# EAGLE design NEW MD 裏 - コピー (EAGLE 9.6.2)
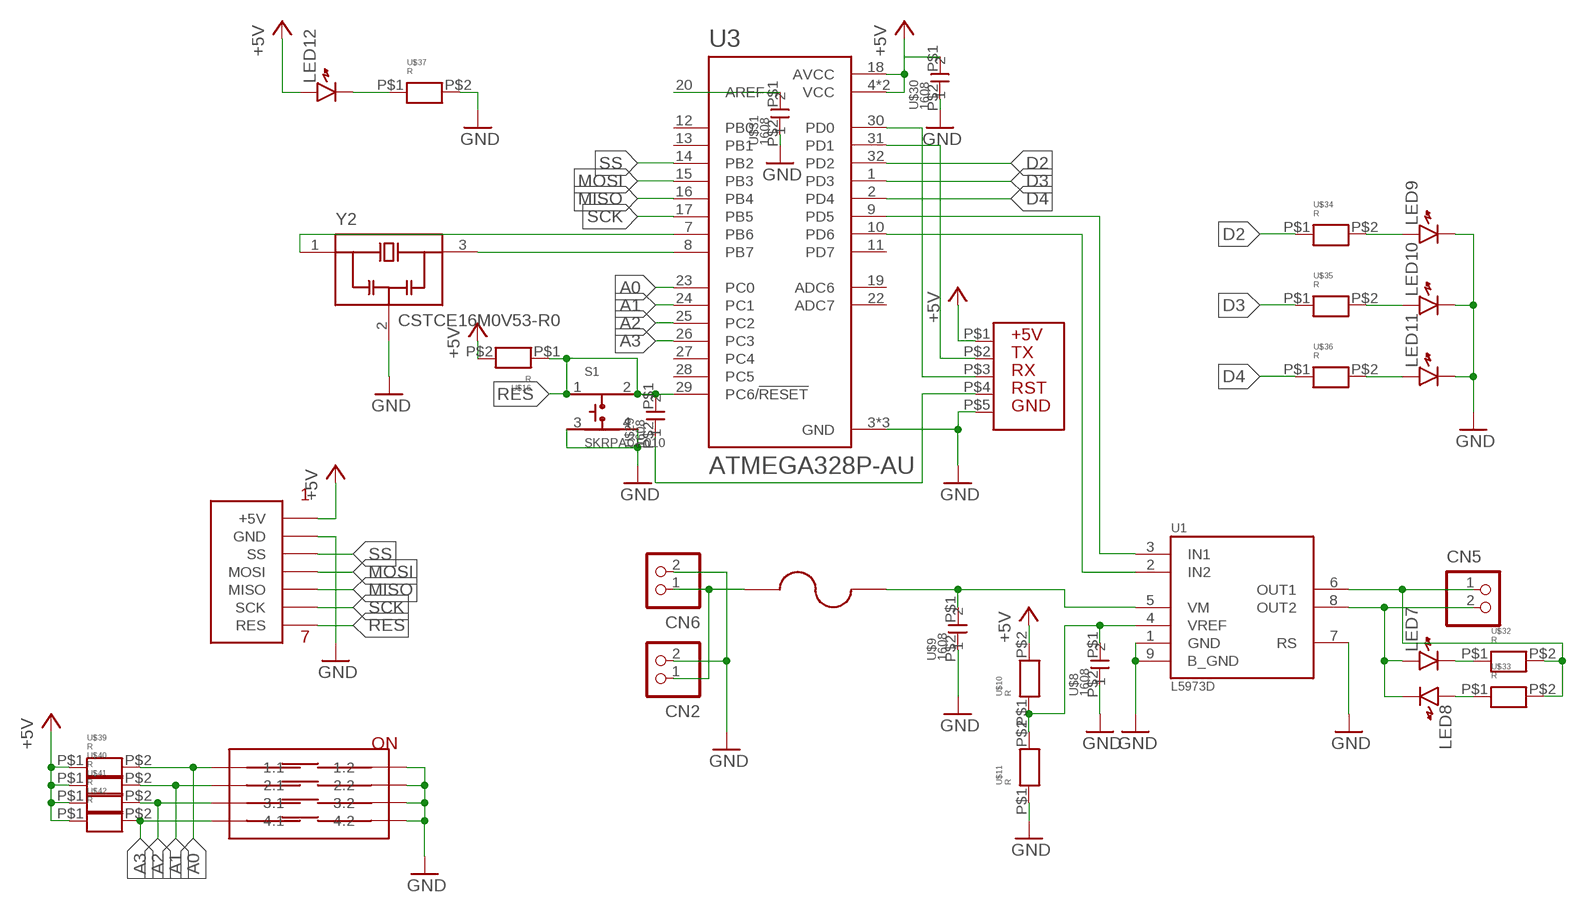
[diagram p0: schematic, sheet 1]

## Parts
CN2  B2B-XH-A  [B2B-XH-A]
CN5  S2B-XH-A  [S2B-XH-A]
CN6  B2B-XH-A  [B2B-XH-A]
LED7  LED1608  [LED1608]
LED8  LED1608  [LED1608]
LED9  LED1608  [LED1608]
LED10  LED1608  [LED1608]
LED11  LED1608  [LED1608]
LED12  LED1608  [LED1608]
S1  SKRPACE010  [SW_SKRPACE010]
U1  L5973D  [SOIC127P600X170-9N]
U3  ATMEGA328P-AU  [QFP80P900X900X120-32N]
U$1  FUSE3.7A  [FUSE3.7A]
U$8  1608  [CON]
U$9  1608  [CON]
U$10  R  [1608]
U$11  R  [1608]
U$16  R  [1608]
U$29  1608  [CON]
U$30  1608  [CON]
U$31  1608  [CON]
U$32  R  [1608]
U$33  R  [1608]
U$34  R  [1608]
U$35  R  [1608]
U$36  R  [1608]
U$37  R  [1608]
U$38  4P  [4P]
U$39  R  [1608]
U$40  R  [1608]
U$41  R  [1608]
U$42  R  [1608]
U$43  SPI  [SPI]
U$44  SI  [SI]
Y2  CSTCE16M0V53-R0  [OSC_CSTCE16M0V53-R0]

## Nets
+5V: LED12.A U3.4(VCC) U3.6(VCC) U3.18(AVCC) U$10.P$2 U$16.P$2 U$30.P$1 U$39.P$1 U$40.P$1 U$41.P$1 U$42.P$1 U$43.P$1(+5V) U$44.P$1
A0: U3.23(PC0) U$38.1.1 U$39.P$2
A1: U3.24(PC1) U$38.2.1 U$40.P$2
A2: U3.25(PC2) U$38.3.1 U$41.P$2
A3: U3.26(PC3) U$38.4.1 U$42.P$2
D2: U3.32(PD2) U$34.P$1
D3: U3.1(PD3) U$35.P$1
D4: U3.2(PD4) U$36.P$1
GND: CN2.2 CN6.2 LED9.K LED10.K LED11.K S1.3 S1.4 U1.1(GND) U1.7(RS) U1.9(B_GND) U3.3(GND) U3.5(GND) U3.21(GND) U$8.P$2 U$9.P$2 U$11.P$1 U$30.P$2 U$31.P$2 U$37.P$2 U$38.1.2 U$38.2.2 U$38.3.2 U$38.4.2 U$43.P$2(GND) U$44.P$5 Y2.2(GND)
MISO: U3.16(PB4) U$43.P$5(MISO)
MOSI: U3.15(PB3) U$43.P$4(MOSI)
N$8: U1.5(VM) U$1.P$2 U$9.P$1
N$9: U1.4(VREF) U$8.P$1 U$10.P$1 U$11.P$2
N$10: U3.20(AREF) U$31.P$1
N$11: U$29.P$2 U$44.P$4
N$12: U3.31(PD1) U$44.P$2
N$14: U3.30(PD0) U$44.P$3
N$20: CN2.1 CN6.1 U$1.P$1
N$21: CN5.2 LED7.A LED8.K U1.8(OUT2)
N$22: CN5.1 U1.6(OUT1) U$32.P$2 U$33.P$2
N$23: U1.2(IN2) U3.10(PD6)
N$26: U1.3(IN1) U3.9(PD5)
N$27: U3.7(PB6) Y2.1(IN)
N$28: U3.8(PB7) Y2.3(OUT)
N$29: LED8.A U$33.P$1
N$30: LED7.K U$32.P$1
N$34: LED10.A U$35.P$2
N$35: LED9.A U$34.P$2
N$36: LED11.A U$36.P$2
N$38: LED12.K U$37.P$1
RES: S1.1 S1.2 U3.29(PC6/!RESET) U$16.P$1 U$29.P$1 U$43.P$7(RES)
SCK: U3.17(PB5) U$43.P$6(SCK)
SS: U3.14(PB2) U$43.P$3(SS)
Unconnected: U3.11(PD7) U3.12(PB0) U3.13(PB1) U3.19(ADC6) U3.22(ADC7) U3.27(PC4) U3.28(PC5)

## Library data of the parts
CN2 CN6 = jst-xh:B2B-XH-A: Wire-to-Board 2.5mm pitch top mount connector Source: http://www.jst-mfg.com/product/pdf/jpn/XH.pdf http://www.jst-mfg.com/product/detail.php?series=277
CN5 = jst-xh:S2B-XH-A: Wire-to-Board 2.5mm pitch side mount connector Source: http://www.jst-mfg.com/product/pdf/jpn/XH.pdf http://www.jst-mfg.com/product/detail.php?series=277
LED7-LED12 = generic:LED: Generic LEDs
S1 = SKRPACE010:SKRPACE010: Switch Tactile N.O. SPST Button J-Bend 0.05A 16VDC 2.55N SMD Automotive T/R Check prices <https://pricing.snapeda.com/parts/SKRPACE010/ALPS/view-part?ref=eda>; AVAILABILITY: In Stock; DESCRIPTION: Switch Tactile N.O. SPST Button J-Bend 0.05A 16VDC 2.55N SMD Automotive T/R; MF: ALPS; MP: SKRPACE010; PACKAGE: None; PRICE: None
U1 = MD TOSHIBA:L5973D: L5973D Series 36 V 2.5 A Switch Step Down Switching Regulator SMT - HSOP-8 Check prices <https://pricing.snapeda.com/parts/L5973D/STMicroelectronics/view-part?ref=eda>; AVAILABILITY: In Stock; DESCRIPTION: Buck Switching Regulator IC Positive Adjustable 1.235V 1 Output 2.5A 8-SOIC (0.154, 3.90mm Width) Exposed Pad; MF: STMicroelectronics; MP: L5973D; PACKAGE: HSOP-8 STMicroelectronics; PRICE: None; PURCHASE-URL: https://pricing.snapeda.com/search/part/L5973D/?ref=eda
U3 = ATMEGA328P-AU:ATMEGA328P-AU: ATmega Series 20 MHz 32 KB Flash 2 KB SRAM 8-Bit Microcontroller - TQFP-32 Check prices <https://pricing.snapeda.com/parts/ATMEGA328P-AU/Microchip%20Technology/view-part?ref=eda>; AVAILABILITY: In Stock; DESCRIPTION: AVR AVR® ATmega Microcontroller IC 8-Bit 20MHz 32KB (16K x 16) FLASH 32-TQFP (7x7); MF: Microchip Technology; MP: ATMEGA328P-AU; PACKAGE: TQFP-32 Microchip; PRICE: None
U$1 = FUSE 3.7A:FUSE3.7A
U$8 U$9 U$29-U$31 = con1608:1608
U$10 U$11 U$16 U$32-U$37 U$39-U$42 = R 1608:R
U$38 = DIPスイッチ:4P
U$43 = SPI用PH7ピン:SPI
U$44 = プログラム入力:SI
Y2 = CSTCE16M0V53-R0:CSTCE16M0V53-R0: 20MHz Ceramic Resonator Built in Capacitor 15pF +/- 0.2% -40C - 125C Surface Mount; MANUFACTURER: Murata; MAXIMUM_PACKAGE_HEIGHT: 1.00mm; PARTREV: May 7, 2019; STANDARD: Manufacturer Recommendations

## Board
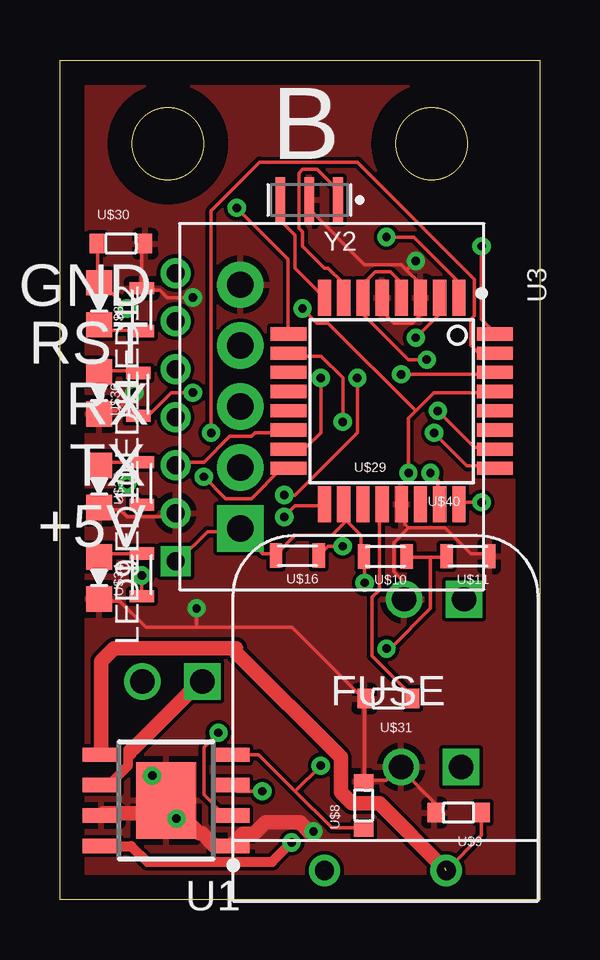
[diagram p1: board, top side]
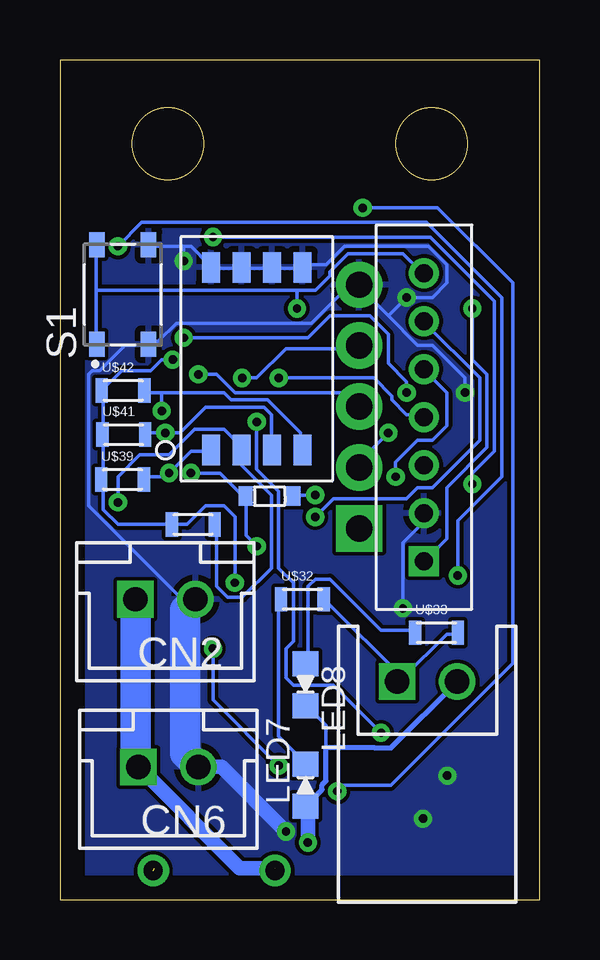
[diagram p2: board, bottom side, seen from below]

Size 20 x 34.99 mm. Coordinates in mm from the lower left corner, seen from the top.
Outline: 0,34.99 20,34.98 20,0.01 0,0 0,34.99
Outline: circle at 4.5,31.5 radius 1.5
Outline: circle at 15.5,31.5 radius 1.5
Outline: circle at 4.5,31.5 radius 1.5
Outline: circle at 15.5,31.5 radius 1.5
Copper layers (1*16): Top 0.035mm / dielectric 1.5mm / Bottom 0.035mm
Design rules "default": minimum track width 6mil, minimum drill 0.35mm, track to track 6mil, track to pad 6mil, pad to pad 6mil, via to via 6mil, smd to smd 6mil, copper to edge 40mil, drill to drill 6mil, minimum pad ring 10mil, minimum via ring 8mil, stop-mask expansion 4mil, vias tented up to drill 0mil, thermal gap 10mil

### Footprints (pad centres in the part's own frame; a part is rotated, then mirrored left to right if it is on the bottom)
B2B-XH-A = drill 1.016 square: 1 -1.25,0 | drill 1.016: 2 1.25,0
S2B-XH-A = drill 1.016 square: 1 1.25,0 | drill 1.016: 2 -1.25,0
LED1608 = smd 1.05 x 1.08: A -0.875,0; K 0.875,0
SW_SKRPACE010 = smd 1.05 x 0.65: 1 -2.075,1.075; 2 2.075,1.075; 3 -2.075,-1.075; 4 2.075,-1.075
SOIC127P600X170-9N = smd 1.55 x 0.6: 1 -2.7,1.905; 2 -2.7,0.635; 3 -2.7,-0.635; 4 -2.7,-1.905; 5 2.7,-1.905; 6 2.7,-0.635; 7 2.7,0.635; 8 2.7,1.905 | smd 2.5 x 3.2: 9 0,0
QFP80P900X900X120-32N = smd 1.5 x 0.55: 1 -4.3,2.8; 2 -4.3,2; 3 -4.3,1.2; 4 -4.3,0.4; 5 -4.3,-0.4; 6 -4.3,-1.2; 7 -4.3,-2; 8 -4.3,-2.8; 17 4.3,-2.8; 18 4.3,-2; 19 4.3,-1.2; 20 4.3,-0.4; 21 4.3,0.4; 22 4.3,1.2; 23 4.3,2; 24 4.3,2.8 | smd 0.55 x 1.5: 9 -2.8,-4.3; 10 -2,-4.3; 11 -1.2,-4.3; 12 -0.4,-4.3; 13 0.4,-4.3; 14 1.2,-4.3; 15 2,-4.3; 16 2.8,-4.3; 25 2.8,4.3; 26 2,4.3; 27 1.2,4.3; 28 0.4,4.3; 29 -0.4,4.3; 30 -1.2,4.3; 31 -2,4.3; 32 -2.8,4.3
FUSE3.7A = drill 0.8: P$1 0,0; P$2 5.08,0
CON = smd 0.6 x 0.813: P$1 -1,0; P$2 1,0
1608 = smd 0.508 x 1.016: P$1 -0.889,0; P$2 0.889,0
4P = smd 0.76 x 1.27: 1.1 0,0; 1.2 0,7.62; 2.1 1.27,0; 2.2 1.27,7.62; 3.1 2.54,0; 3.2 2.54,7.62; 4.1 3.81,0; 4.2 3.81,7.62
SPI = drill 0.75 square: P$1 0,0 | drill 0.75: P$2 2,0; P$3 4,0; P$4 6,0; P$5 8,0; P$6 10,0; P$7 12,0
SI = drill 1.1 pad 1.93 square: P$1 -7.62,0 | drill 1.1 pad 1.93: P$2 -5.08,0; P$3 -2.54,0; P$4 0,0; P$5 2.54,0
OSC_CSTCE16M0V53-R0 = smd 0.4 x 1.9: 1 -1.2,0; 2 0,0; 3 1.2,0

### Placement (x,y rotation side)
CN2  15.6,12.52 0 bottom
CN5  4.68,9.09 180 bottom
CN6  15.48,5.54 0 bottom
LED7  9.76,4.77 90 bottom
LED8  9.76,8.96 270 bottom
LED9  1.63,13.41 270 top
LED10  1.63,17.22 270 top
LED11  1.63,21.12 270 top
LED12  1.63,24.84 270 top
S1  17.38,25.22 90 bottom
U1  4.43,4.14 180 top
U3  13.84,20.78 270 top
U$1  11.03,1.22 0 top
U$8  12.67,3.94 90 top
U$9  16.62,3.63 180 top
U$10  13.57,14.3 180 top
U$11  17.01,14.31 180 top
U$16  9.9,14.34 180 top
U$29  11.26,16.81 0 bottom
U$30  2.55,27.34 0 top
U$31  13.7,8.38 180 top
U$32  9.89,12.52 0 bottom
U$33  4.3,11.12 0 bottom
U$34  3.41,13.54 90 top
U$35  3.41,17.35 90 top
U$36  3.27,21.06 90 top
U$37  3.41,24.59 90 top
U$38  13.7,18.73 0 bottom
U$39  17.39,17.51 0 bottom
U$40  14.45,15.63 0 bottom
U$41  17.34,19.38 0 bottom
U$42  17.37,21.22 0 bottom
U$43  4.82,14.11 90 bottom
U$44  7.52,23.09 90 top
Y2  10.4,29.16 180 top

### Tracks (layer width: path | path; a pad name or v marks a point on that pad's centre or on a via)
+5V  (via drill 0.35)
  Top 0.152: U3.4 14.23,25.09 14.23,25.7 13.77,26.16 13.16,26.16 12.71,25.7 12.71,25.09 U3.6 12.71,24.94 12.71,24.33 14.54,22.5 v15.3,22.5 | 11.94,15.8 12.55,15.19 12.55,14.43 U$10.P$2 12.71,14.27 v12.71,13.21 | 11.94,15.8 11.94,16.41 U3.18 11.94,15.8 | 7.53,15.34 8.44,14.43 8.9,14.43 U$16.P$2 9.05,14.43 9.81,15.19 11.34,15.19 11.94,15.8 | U$30.P$1 1.58,27.23 1.58,25.86 LED12.A 1.73,25.7 v2.8,24.64 | 7.53,15.34 6.15,15.34 4.93,14.12 U$43.P$1 | 7.53,15.34 U$44.P$1
  Bottom 0.152: v15.3,22.5 15.75,22.5 16.21,22.05 17.43,22.05 U$42.P$1 18.19,21.13 18.19,19.46 U$41.P$1 18.19,19.3 18.19,17.63 U$39.P$1 18.19,17.47 18.19,16.25 17.58,15.64 15.45,15.64 U$40.P$1 15.3,15.64 14.69,15.64 13.93,16.41 13.16,16.41 12.71,15.95 v12.71,13.21 | v2.8,24.64 2.8,22.5 2.19,21.89 2.19,18.85 3.87,17.17 3.87,15.04 4.78,14.12 U$43.P$1
A0  (via drill 0.35)
  Top 0.152: v15.45,17.78 15.75,17.47 15.75,16.56 U3.23
  Bottom 0.152: U$39.P$2 16.36,17.63 15.6,17.63 v15.45,17.78 14.54,18.69 13.77,18.69 U$38.1.1
A1  (via drill 0.35)
  Top 0.152: v17.58,16.56 16.67,16.56 U3.24
  Bottom 0.152: U$40.P$2 13.47,15.49 13.47,13.05 13.01,12.6 12.4,12.6 11.18,13.82 11.18,16.86 12.4,18.08 12.4,18.69 U$38.2.1 12.4,18.85 13.16,19.61 14.38,19.61 15.45,18.54 16.67,18.54 17.58,17.63 v17.58,16.56
A2  (via drill 0.35)
  Top 0.152: v15.6,19.46 16.97,18.08 18.04,18.08 U3.25
  Bottom 0.152: U$41.P$2 16.36,19.46 v15.6,19.46 14.99,19.46 13.93,20.52 11.49,20.52 11.18,20.22 11.18,18.85 U$38.3.1
A3  (via drill 0.35)
  Top 0.152: v15.75,20.37 17.28,18.85 18.04,18.85 U3.26
  Bottom 0.152: 15.75,21.13 13.16,21.13 12.86,20.83 11.34,20.83 9.96,19.46 9.96,18.85 U$38.4.1 | 15.75,21.13 16.36,21.13 U$42.P$2 | 15.75,21.13 v15.75,20.37
D2  (via drill 0.35)
  Top 0.152: v3.41,13.51 U$34.P$1 | v17.58,27.23 17.58,24.18 18.04,23.72 U3.32
  Bottom 0.152: v3.41,13.51 3.41,15.8 1.58,17.63 1.58,25.09 4.71,28.22 16.59,28.22 v17.58,27.23
D3  (via drill 0.35)
  Top 0.152: v2.8,17.32 2.8,17.17 3.41,16.56 U$35.P$1 | v13.62,27.61 14.76,27.61 16.52,25.86 16.52,25.09 U3.1
  Bottom 0.152: v2.8,17.32 2.8,17.78 1.89,18.69 1.89,24.94 4.56,27.61 v13.62,27.61
D4  (via drill 0.35)
  Top 0.152: v5.54,21.13 4.63,21.13 3.72,20.22 3.41,20.22 U$36.P$1 | v14.84,23.42 15.75,24.33 15.75,24.94 U3.2
  Bottom 0.152: v5.54,21.13 5.54,21.59 6.31,22.35 6.31,23.57 7.07,24.33 8.74,24.33 9.66,23.42 v14.84,23.42
GND  (via drill 0.35)
  Top 0.152: U3.5 13.47,24.94 13.47,24.48 13.93,24.03 14.69,24.03 14.99,24.33 14.99,24.94 U3.3 14.99,25.09 14.99,25.7 14.46,26.24 | 14.46,26.24 14.23,26.47 12.71,26.47 10.42,28.75 10.42,29.06 Y2.2 | U$30.P$2 3.41,27.23 U$37.P$2 3.41,25.4 4.17,25.4 4.48,25.09 v5.54,25.09 | v3.11,21.13 2.34,20.37 1.73,20.37 LED11.K | v14.84,26.62 14.46,26.24 | 14.54,15.49 16.06,15.49 17.13,14.43 17.89,14.43 U$11.P$1 | 14.54,15.49 14.38,15.64 14.38,16.41 U3.21 | 14.54,15.49 13.93,14.88 13.93,13.66 14.23,13.36 14.23,12.6 CN2.2 | 3.87,3.61 4.32,4.06 U1.9 | LED10.K 1.73,16.25 2.5,16.25 2.8,15.95 4.63,15.95 4.78,16.1 U$43.P$2 | 12.71,4.98 13.62,4.98 14.08,5.43 CN6.2 14.23,5.43 15.6,4.06 15.6,3.76 U$9.P$2 | 12.71,4.98 12.71,8.33 U$31.P$2 12.55,8.48 9.68,11.35 5.7,11.35 | 12.71,4.98 U$8.P$2 | 5.7,11.35 3.59,11.35 2.5,12.45 1.73,12.45 LED9.K | 5.7,11.35 v5.7,12.14
  Top 0.61: U1.7 1.83,3.61 3.87,3.61 | U1.9 5.8,2.77 5.92,2.77 6.45,2.23 U1.1 7.64,2.75 8.09,2.75 8.56,3.22 10,3.22 10.38,2.84 v10.57,2.84
  Bottom 0.152: 14.84,27.23 14.54,27.23 13.77,26.47 U$38.1.2 13.62,26.31 12.55,26.31 U$38.2.2 12.4,26.31 11.18,26.31 U$38.3.2 11.03,26.31 9.96,26.31 U$38.4.2 9.81,26.47 8.9,26.47 8.13,27.23 4.63,27.23 3.87,26.47 3.87,25.7 4.48,25.09 v5.54,25.09 6.31,24.33 | 14.84,27.23 16.21,27.23 S1.4 | 7.53,25.55 7.98,25.55 9.51,24.03 15.15,24.03 15.91,23.27 16.21,23.27 S1.3 16.36,23.11 17.28,23.11 18.34,22.05 18.65,22.05 18.8,21.89 18.8,16.41 14.99,12.6 14.38,12.6 CN2.2 | v3.11,21.13 3.11,21.74 4.48,23.11 5.09,23.11 6.31,24.33 | 7.53,25.55 6.31,24.33 | 7.53,25.55 U$44.P$5 | 14.84,27.23 v14.84,26.62 | v5.7,12.14 5.7,14.88 4.93,15.64 4.93,16.1 U$43.P$2
  Bottom 0.61: v10.57,2.84 13.27,5.54 CN6.2 14.46,5.77
  Bottom 1.27: CN2.2 14.79,12.09 14.79,6.1 14.46,5.77
  other vias: 3.85,5.17 4.86,3.38
  pour Top: -6.75,40.08 -6.75,-3.1 22.46,-3.1 22.46,40.08
  pour Bottom: -8.02,40.08 -8.02,-4.37 23.73,-4.37 23.73,41.35 -8.02,41.35
MISO  (via drill 0.35)
  Top 0.152: v6,17.63 6.92,16.71 7.98,16.71 9.2,17.93 9.51,17.93 U3.16
  Bottom 0.152: v6,17.63 6,18.24 5.09,19.15 4.48,19.15 3.87,19.76 3.87,21.13 4.78,22.05 U$43.P$5
MOSI  (via drill 0.35)
  Top 0.152: v10.88,21.74 10.88,19.46 10.27,18.85 9.66,18.85 U3.15
  Bottom 0.152: v10.88,21.74 6.92,21.74 6.15,20.98 6.15,20.83 5.54,20.22 4.93,20.22 U$43.P$4
N$8  (1 unrouted)
  Top 0.152: U$1.P$2 17.58,2.69 17.58,3.61 U$9.P$1
  Top 0.61: 16.06,1.32 16.11,1.32 | U$1.P$2 13.32,4.01 12.17,4.01 11.71,4.47 11.71,5.93 7.35,10.3 7.35,10.49 2.27,10.49 1.73,9.95 U1.5
N$9  (via drill 0.35)
  Top 0.152: 15.45,14.27 16.06,14.27 U$11.P$2 | 15.45,14.27 14.54,14.27 U$10.P$1 | 9.81,4.52 8.29,6.04 U1.4 | 9.81,4.52 11.34,3 12.55,3 U$8.P$1 | 15.45,14.27 15.45,12.14 13.77,10.46 v13.62,10.46 | 9.81,4.52 v10.88,5.59
  Bottom 0.152: v13.62,10.46 13.62,8.33 v10.88,5.59
N$10
  Top 0.152: U$31.P$1 14.69,8.48 13.01,10.16 13.01,12.6 13.32,12.9 13.32,16.41 U3.20
N$11  (via drill 0.35)
  Top 0.152: v9.35,16.86 9.81,16.86 12.4,19.46 v12.4,21.74
  Bottom 0.152: v9.35,16.86 10.12,16.86 U$29.P$2 | v12.4,21.74 11.79,21.74 10.57,22.96 7.53,22.96 U$44.P$4
N$12  (via drill 0.35)
  Top 0.152: v6.31,19.46 6.31,28.71 8.33,30.73 12.4,30.73 17.28,25.86 17.28,24.33 17.13,24.18 17.13,23.11 17.43,22.81 18.04,22.81 U3.31
  Bottom 0.152: v6.31,19.46 7.53,18.24 U$44.P$2
N$14  (via drill 0.35)
  Top 0.152: v14.23,21.89 18.04,21.89 U3.30
  Bottom 0.152: v14.23,21.89 13.47,21.89 12.71,21.13 7.98,21.13 7.53,20.67 U$44.P$3
N$20  (1 unrouted)
  Bottom 0.152: 11.03,1.32 U$1.P$1
  Bottom 0.61: CN6.1 12.51,1.32 11.03,1.32
  Bottom 1.27: CN2.1 16.85,9.6 16.85,5.66 CN6.1
N$21  (via drill 0.35)
  Top 0.406: U1.8 2.98,2.23 3.64,1.57 8.85,1.57 v9.66,2.39
  Bottom 0.152: 8.9,6.35 8.9,7.26 9.66,8.03 LED8.K | 9.66,3.76 LED7.A
  Bottom 0.203: LED7.A 9.07,4.59 9.07,4.78 8.9,4.96 8.9,6.35 6.9,6.35 6.87,6.33 6.2,6.33 CN5.2
  Bottom 0.61: v9.66,2.39 9.66,3.76
N$22
  Top 0.152: 2.8,5.59 2.8,6.04 2.8,6.34
  Top 0.203: 3.09,6.33 3.09,6.04 2.92,5.87 2.92,5.56 2.82,5.56 | 2.59,5.33 2.76,5.5 2.76,6.3 2.8,6.34 | 2.8,6.04 2.98,6.22
  Top 0.406: U1.6 2.03,4.77 2.59,5.33 2.82,5.56
  Top 0.61: CN5.1 5.85,9.09 3.09,6.33 2.98,6.22
  Bottom 0.152: 5.7,9.24 5.85,9.09 CN5.1 5.7,9.24 | 5.7,9.24 3.87,11.07 3.41,11.07 U$33.P$2 | 5.7,9.24 8.9,12.45 U$32.P$2
N$23  (via drill 0.35)
  Top 0.152: v11.79,19.91 11.79,21.74 10.88,22.66 9.66,22.66 U3.10 | v6.61,6.96 6,6.35 6,4.37 6.76,3.61 7.07,3.61 U1.2
  Bottom 0.152: v11.79,19.91 11.79,17.93 10.88,17.02 10.88,13.82 10.27,13.21 10.27,10.77 10.57,10.46 10.57,9.24 10.27,8.94 8.59,8.94 v6.61,6.96
N$26  (via drill 0.35)
  Top 0.152: v7.37,28.83 9.51,26.7 9.51,23.72 U3.9 | v8.44,4.52 7.37,4.52 7.22,4.67 U1.3
  Bottom 0.152: v7.37,28.83 4.25,28.83 1.12,25.7 1.12,9.85 6.21,4.77 8.19,4.77 v8.44,4.52
N$27
  Top 0.152: U3.7 11.79,25.09 11.79,25.7 11.18,26.31 11.03,26.31 10.12,27.23 10.12,27.84 9.96,27.99 9.96,30.28 10.12,30.43 10.73,30.43 11.49,29.67 11.49,29.21 Y2.1
N$28
  Top 0.152: U3.8 11.03,25.09 9.81,26.31 9.81,27.69 9.2,28.29 9.2,29.06 Y2.3
N$29
  Bottom 0.152: U$33.P$1 5.24,11.23 6.61,11.23 8.74,13.36 9.35,13.36 9.66,13.05 9.66,9.85 LED8.A
N$30
  Bottom 0.152: U$32.P$1 10.88,12.45 10.88,6.81 9.81,5.74 LED7.K
N$34
  Top 0.152: U$35.P$2 1.73,18.24 LED10.A
N$35
  Top 0.152: U$34.P$2 1.73,14.43 LED9.A
N$36
  Top 0.152: U$36.P$2 3.26,22.05 1.73,22.05 LED11.A
N$38
  Top 0.152: U$37.P$1 3.41,23.72 1.89,23.72 1.73,23.88 LED12.K
RES  (via drill 0.35)
  Top 0.152: v11.79,14.73 11.18,14.73 U$16.P$1 | 14.84,20.37 14.54,20.07 v14.54,17.78 | 14.84,20.37 15.6,21.13 18.04,21.13 U3.29 | 14.84,20.37 11.18,24.03 10.73,24.03 v10.12,24.64
  Bottom 0.152: v11.79,14.73 12.25,15.19 12.25,16.71 U$29.P$1 12.4,16.86 13.32,17.78 v14.54,17.78 | 18.5,25.4 18.5,27.23 S1.2 | 18.5,25.4 18.5,23.27 S1.1 | 10.12,25.4 9.35,25.4 8.74,26.01 8.74,26.16 7.98,26.92 5.7,26.92 4.93,26.16 U$43.P$7 | 10.12,25.4 18.5,25.4 | 10.12,25.4 v10.12,24.64
SCK  (via drill 0.35)
  Top 0.152: v9.35,15.95 9.81,16.41 11.03,16.41 U3.17
  Bottom 0.152: v9.35,15.95 8.59,16.71 5.54,16.71 5.09,17.17 4.48,17.17 2.5,19.15 2.5,21.74 4.78,24.03 U$43.P$6
SS
  Top 0.152: U3.14 9.51,19.46 8.13,19.46 7.98,19.3 7.07,19.3 6,18.24 4.93,18.24 U$43.P$3

### Text on the board
tPlace: B